# EAGLE design Relay (EAGLE 7.2.0)
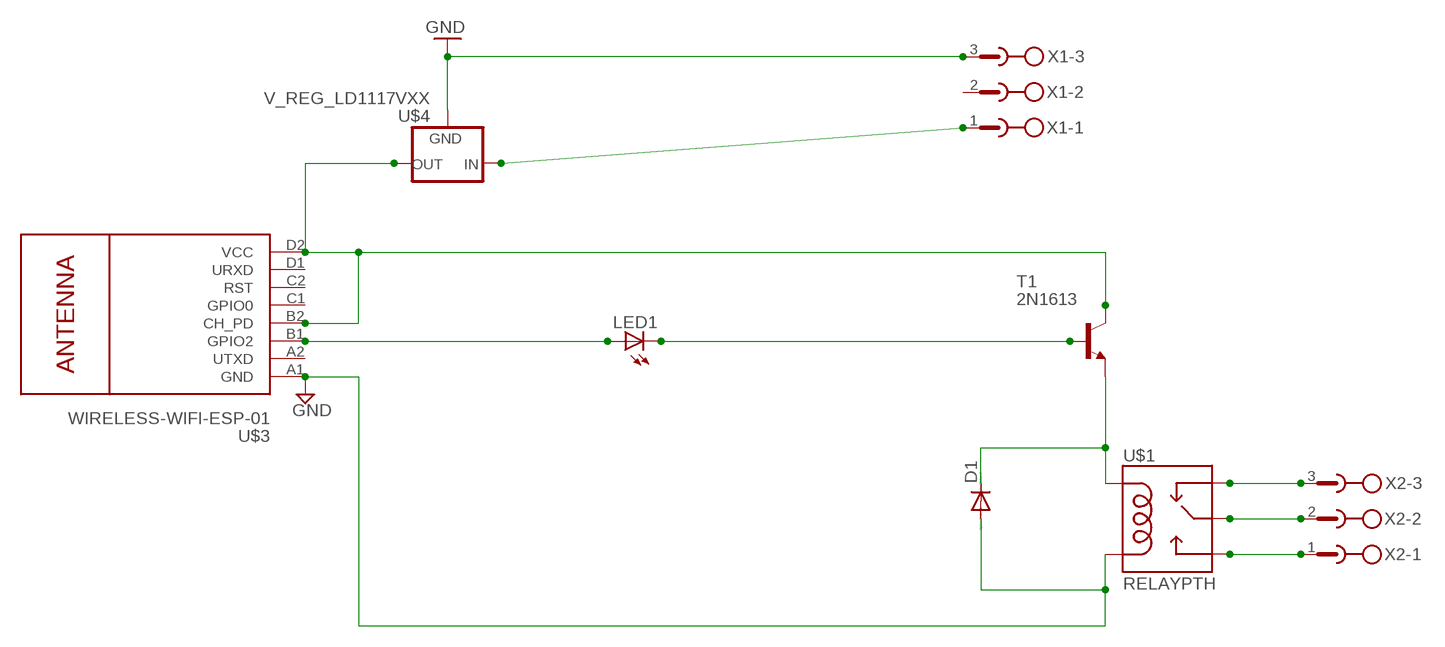
[diagram p0: schematic, sheet 1]

## Parts
D1  DIODE-D-2.5  [D-2.5]
LED1  LED3MM  [LED3MM]
T1  2N1613  [TO5]
U$1  RELAYPTH  [SRD-05VDC-SL-C]
U$3  WIRELESS-WIFI-ESP-01  [WIRELESS-WIFI-ESP-01]
U$4  V_REG_LD1117VXX  [78XXL]
X1  W232-3  [W232-3]
X2  W232-3  [W232-3]

## Nets
GND: D1.A U$1.COIL0 U$3.A1(GND) U$4.IN(GND) X1.3
N$1: T1.3(C) U$3.B2(CH_PD) U$3.D2(VCC) U$4.GND(OUT)
N$2: LED1.A U$3.B1(GPIO2)
N$4: U$4.OUT(IN) X1.1
N$5: LED1.K(C) T1.2(B)
N$7: U$1.SWCLOSED(SWCLOSE) X2.3
N$8: D1.C T1.1(E) U$1.COIL1
N$9: U$1.SWCOMMON X2.2
N$10: U$1.SWOPEN X2.1
Unconnected: U$3.A2(UTXD) U$3.C1(GPIO0) U$3.C2(RST) U$3.D1(URXD) X1.2

## Library data of the parts
D1 = diode:DIODE-: DIODE
LED1 = led:LED: LED OSRAM: - CHIPLED LG R971, LG N971, LY N971, LG Q971, LY Q971, LO R971, LY R971 LH N974, LH R974 LS Q976, LO Q976, LY Q976 LO Q996 - Hyper CHIPLED LW Q18S LB Q993, LB Q99A, LB R99A - SideLED LS A670, LO A670, LY A670, LG A670, LP A670 LB A673, LV A673, LT A673, LW A673 LH A674 LY A675 LS A676, LA A676, LO A676, LY A676, LW A676 LS A679, LY A679, LG A679 - Hyper Micro SIDELED® LS Y876, LA Y876, LO Y876, LY Y876 LT Y87S - SmartLED LW L88C, LW L88S LB L89C, LB L89S, LG L890 LS L89K, LO L89K, LY L89K LS L896, LA L896, LO L896, LY L896 - TOPLED LS T670, LO T670, LY T670, LG T670, LP T670 LSG T670, LSP T670, LSY T670, LOP T670, LYG T670 LG T671, LOG T671, LSG T671 LB T673, LV T673, LT T673, LW T673 LH T674 LS T676, LA T676, LO T676, LY T676, LB T676, LH T676, LSB T676, LW T676 LB T67C, LV T67C, LT T67C, LS T67K, LO T67K, LY T67K, LW E67C LS E67B, LA E67B, LO E67B, LY E67B, LB E67C, LV E67C, LT E67C LW T67C LS T679, LY T679, LG T679 LS T770, LO T770, LY T770, LG T770, LP T770 LB T773, LV T773, LT T773, LW T773 LH T774 LS E675, LA E675, LY E675, LS T675 LS T776, LA T776, LO T776, LY T776, LB T776 LHGB T686 LT T68C, LB T68C - Hyper Mini TOPLED® LB M676 - Mini TOPLED Santana® LG M470 LS M47K, LO M47K, LY M47K Source: http://www.osram.convergy.de LUXEON: - LUMILED® LXK2-PW12-R00, LXK2-PW12-S00, LXK2-PW14-U00, LXK2-PW14-V00 LXK2-PM12-R00, LXK2-PM12-S00, LXK2-PM14-U00 LXK2-PE12-Q00, LXK2-PE12-R00, LXK2-PE12-S00, LXK2-PE14-T00, LXK2-PE14-U00 LXK2-PB12-K00, LXK2-PB12-L00, LXK2-PB12-M00, LXK2-PB14-N00, LXK2-PB14-P00, LXK2-PB14-Q00 LXK2-PR12-L00, LXK2-PR12-M00, LXK2-PR14-Q00, LXK2-PR14-R00 LXK2-PD12-Q00, LXK2-PD12-R00, LXK2-PD12-S00 LXK2-PH12-R00, LXK2-PH12-S00 LXK2-PL12-P00, LXK2-PL12-Q00, LXK2-PL12-R00 Source: www.luxeon.com KINGBRIGHT: KA-3528ASYC Source: www.kingbright.com
T1 = transistor:2N1613: NPN TRANSISTOR
U$1 = SRD-05VDC-SL-C:RELAY: SPDT relay (COM-00101)
U$3 = diy-modules:WIRELESS-WIFI-ESP-01: Wireless Wi-Fi ESP-01 Module based on ESP8266 chip
U$4 = SparkFun-PowerIC:V_REG_LD1117VXX: LD1117VXX voltage regulator. We carry the 3.3V version (COM-00526) in TO-220 package.
X1 X2 = con-wago-508:W232-3: WAGO SREW CLAMP; OC_FARNELL: unknown; OC_NEWARK: unknown

## Board
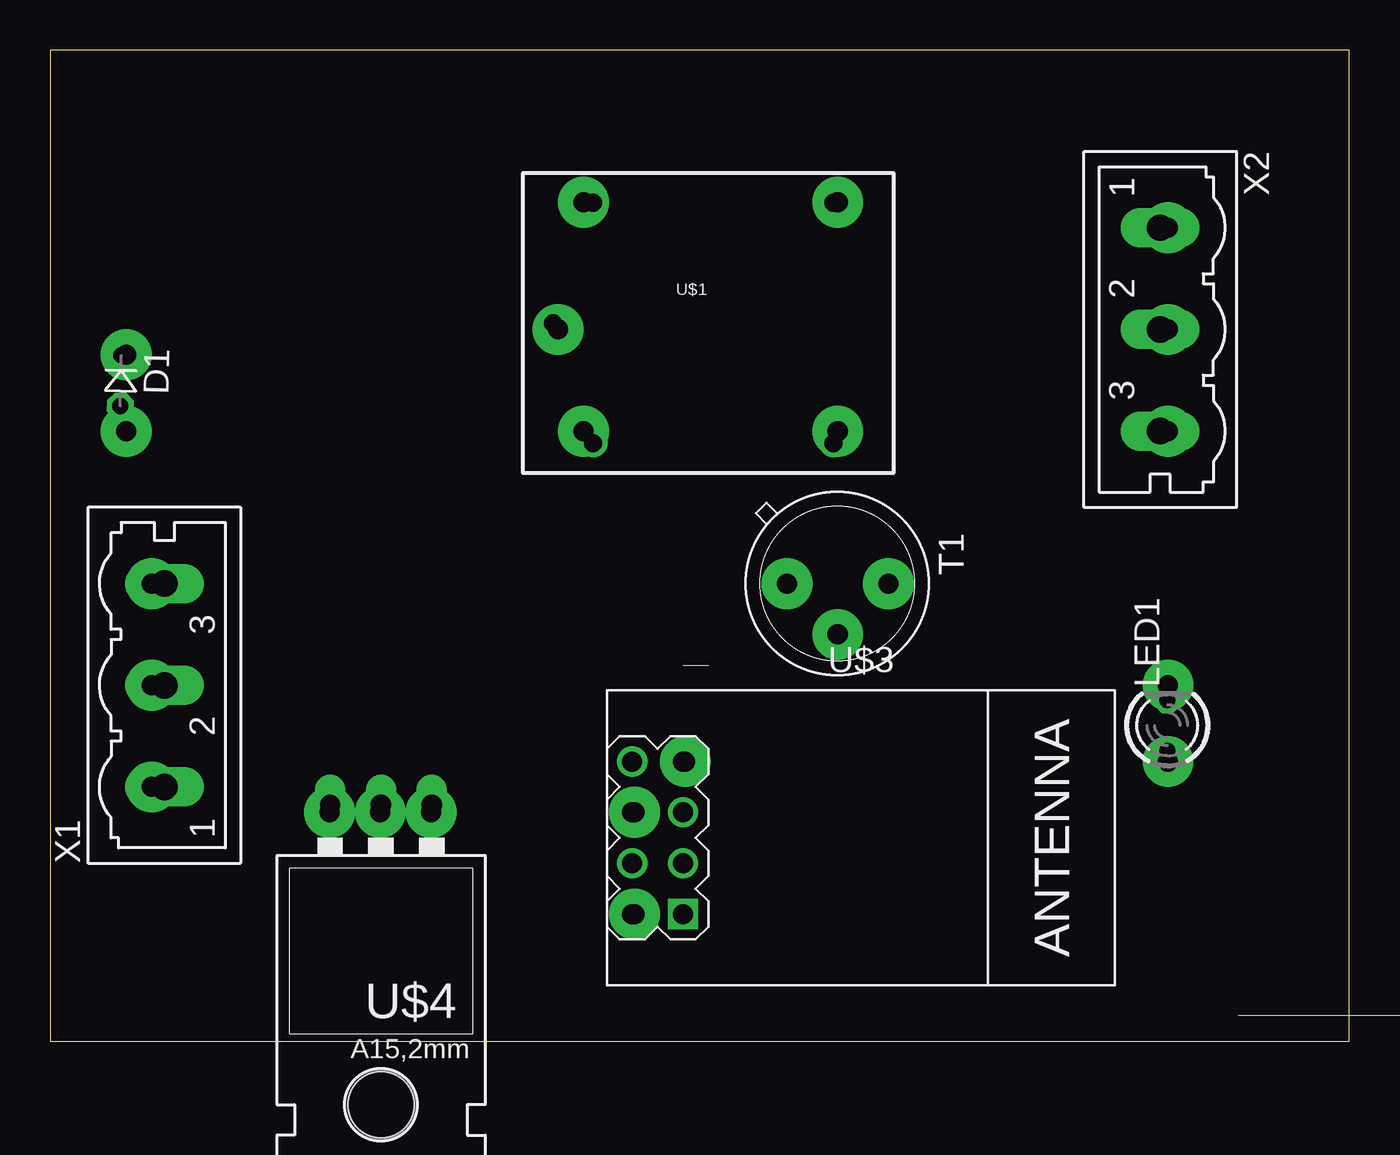
[diagram p1: board, top side]
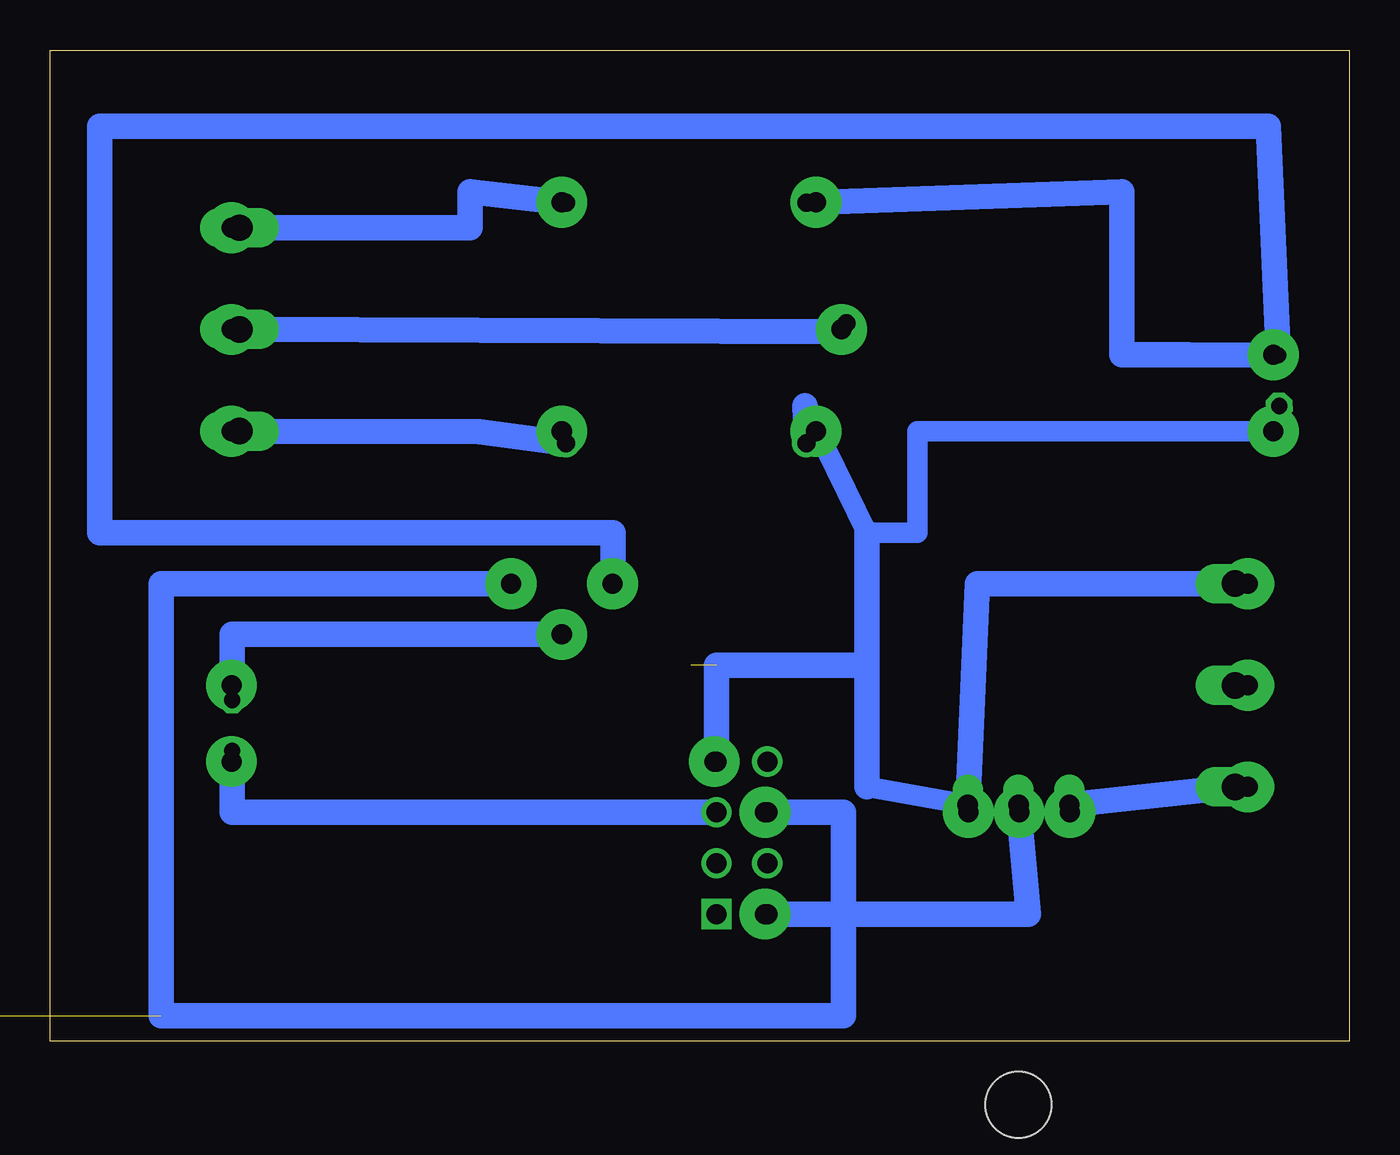
[diagram p2: board, bottom side, seen from below]

Size 64.95 x 49.52 mm. Coordinates in mm from the lower left corner, seen from the top.
Outline: 0,0 64.95,0 64.95,49.52 0,49.52 0,0
Copper layers (1*16): Top 0.035mm / dielectric 1.5mm / Bottom 0.035mm
Design rules "default": minimum track width 10mil, minimum drill 24mil, track to track 8mil, track to pad 8mil, pad to pad 8mil, via to via 8mil, smd to smd 8mil, copper to edge 40mil, drill to drill 8mil, minimum pad ring 10mil, minimum via ring 8mil, stop-mask expansion 4mil, vias tented up to drill 0mil, thermal gap 10mil

### Footprints (pad centres in the part's own frame; a part is rotated, then mirrored left to right if it is on the bottom)
D-2.5 = drill 0.813 octagon: A 1.27,0; C -1.27,0
LED3MM = drill 0.813 octagon: A -1.27,0; K 1.27,0
TO5 = drill 0.813 octagon: 1 0,-2.54; 2 2.54,0; 3 0,2.54
SRD-05VDC-SL-C = drill 0.9: COIL0 -5.39,-6.12; COIL1 -5.39,5.88; SWCLOSED 6.61,-6.12; SWCOMMON -7.39,-0.12; SWOPEN 6.61,5.88
WIRELESS-WIFI-ESP-01 = drill 1 square: A1 -8.89,3.81; D1 -8.89,-3.81 | drill 1: A2 -11.43,3.81; B1 -8.89,1.27; B2 -11.43,1.27; C1 -8.89,-1.27; C2 -11.43,-1.27; D2 -11.43,-3.81
78XXL = drill 1.016 long: GND 0,-3.81; IN -2.54,-3.81; OUT 2.54,-3.81 | hole 3.302: 0,11.176
W232-3 = drill 1.321 long: 1 -5.08,-0.635; 2 0,-0.635; 3 5.08,-0.635

### Placement (x,y rotation side)
D1  3.54,33 268.7 top
LED1  55.85,15.78 90 top
T1  39.34,22.86 270 top
U$1  32.54,36 0 top
U$3  40.53,10.16 0 top
U$4  16.54,8 180 top
X1  5.08,17.78 90 top
X2  56.12,35.56 270 top

### Tracks (layer width: path | path; a pad name or v marks a point on that pad's centre or on a via)
GND  (via drill 1 pad 2.54)  (1 unrouted)
  Bottom 1.016: U$4.IN 24.13,12.7 | 27.22,31.75 24.13,25.4 21.59,25.4 21.59,30.48 v3.81,30.48 3.51,30.48 D1.A
  Bottom 1.27: 24.13,12.7 24.13,18.78 | 24.13,18.78 31.64,18.78 U$3.A1 | X1.3 18.59,22.86 U$4.IN | 27.22,31.75 U$1.COIL0 | 24.13,25.4 24.13,18.78
N$1  (via drill 1 pad 2.54)  (1 unrouted)
  Bottom 1.27: U$4.GND 16.05,6.35 25.29,6.35 | U$3.D2 25.29,6.35 | 25.29,6.35 25.29,11.43 U$3.B2 | 25.29,6.35 25.29,1.27 59.39,1.27 59.39,22.86 v41.91,22.86 T1.3
N$2
  Bottom 1.27: U$3.B1 55.85,11.43 LED1.A
N$3  (via drill 1 pad 2.54)
  other vias: 3.81,34.29
N$4
  Bottom 1.27: X1.1 U$4.OUT
N$5  (via drill 1 pad 2.54)
  Bottom 1.27: T1.2 v39.37,20.32 55.85,20.32 LED1.K
N$6  (via drill 1 pad 2.54)
  other vias: 26.67,41.91
N$7
  Bottom 1.27: U$1.SWCLOSED 43.48,30.44 X2.3
N$8
  Bottom 1.27: T1.1 36.8,25.4 62.47,25.4 62.47,45.72 4.05,45.72 D1.C 8.05,34.29 11.37,34.29 11.37,42.44 U$1.COIL1
N$9
  Bottom 1.27: U$1.SWCOMMON 25.48,35.44 X2.2
N$10
  Bottom 1.27: U$1.SWOPEN 43.96,42.44 43.96,40.64 X2.1
N$11  (via drill 1 pad 2.54)
  other vias: 25.4,35.56
N$12  (via drill 1 pad 2.54)
  other vias: 26.67,30.48
N$13  (via drill 1 pad 2.54)
  other vias: 39.37,30.48
N$14  (via drill 1 pad 2.54)
  other vias: 39.37,41.91
N$15  (via drill 1 pad 2.54)
  other vias: 55.88,40.64
N$16  (via drill 1 pad 2.54)
  other vias: 55.88,35.56
N$17  (via drill 1 pad 2.54)
  other vias: 55.88,30.48
N$18  (via drill 1 pad 2.54)
  other vias: 55.88,17.78
N$19  (via drill 1 pad 2.54)
  other vias: 55.88,13.97
N$20  (via drill 1 pad 2.54)
  other vias: 31.75,13.97
N$21  (via drill 1 pad 2.54)
  other vias: 29.21,11.43
N$22  (via drill 1 pad 2.54)
  other vias: 29.21,6.35
N$23  (via drill 1 pad 2.54)
  other vias: 19.05,11.43
N$24  (via drill 1 pad 2.54)
  other vias: 16.51,11.43
N$25  (via drill 1 pad 2.54)
  other vias: 13.97,11.43
N$26  (via drill 1 pad 2.54)
  other vias: 5.08,12.7
N$27  (via drill 1 pad 2.54)
  other vias: 5.08,17.78
N$28  (via drill 1 pad 2.54)
  other vias: 5.08,22.86
N$29  (via drill 1 pad 2.54)
  other vias: 36.83,22.86